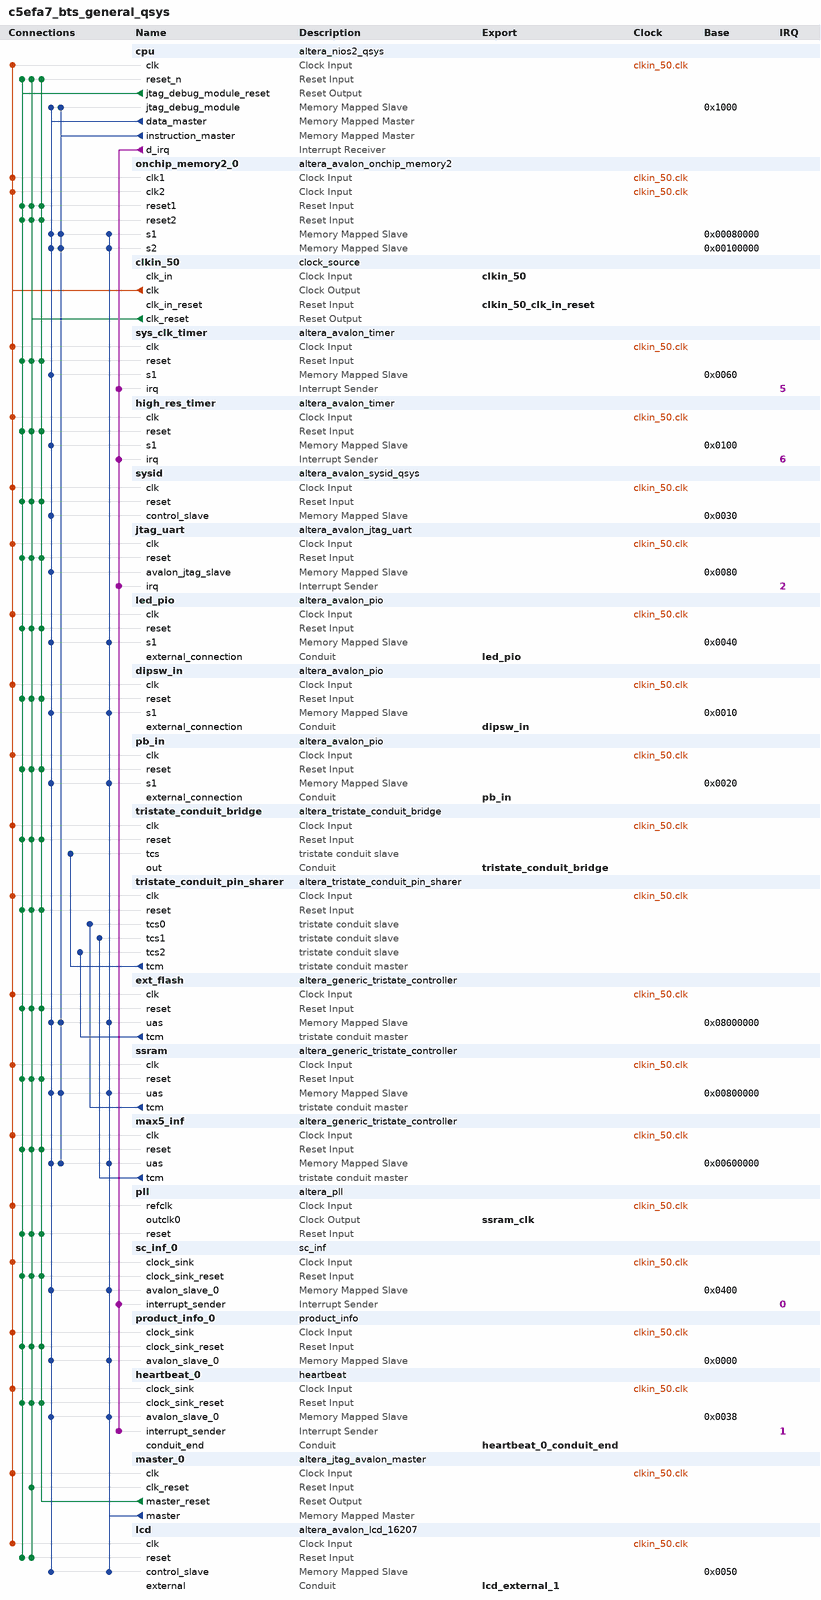
[diagram p0: system contents]
# Platform Designer (Qsys) system c5efa7_bts_general_qsys, Cyclone V 5CEFA7F31I7
# Parameters at their usual value, and those the tool derives, are not listed.
package require -exact qsys 12.1
create_system c5efa7_bts_general_qsys
set_project_property DEVICE_FAMILY {Cyclone V}
set_project_property DEVICE 5CEFA7F31I7

add_instance cpu altera_nios2_qsys 12.1
set_instance_parameter_value cpu manuallyAssignCpuID false
set_instance_parameter_value cpu exceptionOffset 96
set_instance_parameter_value cpu resetSlave onchip_memory2_0.s1
set_instance_parameter_value cpu exceptionSlave onchip_memory2_0.s1
set_instance_parameter_value cpu breakSlave cpu.jtag_debug_module
set_instance_parameter_value cpu muldiv_multiplierType DSPBlock
set_instance_parameter_value cpu impl Tiny
set_instance_parameter_value cpu icache_size 32768
set_instance_parameter_value cpu dcache_size 32768

add_instance onchip_memory2_0 altera_avalon_onchip_memory2 12.1
set_instance_parameter_value onchip_memory2_0 blockType M10K
set_instance_parameter_value onchip_memory2_0 dataWidth 32
set_instance_parameter_value onchip_memory2_0 dualPort true
set_instance_parameter_value onchip_memory2_0 initMemContent true
set_instance_parameter_value onchip_memory2_0 initializationFileName onchip_memory2_0
set_instance_parameter_value onchip_memory2_0 memorySize 524288

add_instance clkin_50 clock_source 12.1
set_instance_parameter_value clkin_50 clockFrequency 50000000

add_instance sys_clk_timer altera_avalon_timer 12.1
set_instance_parameter_value sys_clk_timer period 10
set_instance_parameter_value sys_clk_timer periodUnits MSEC
set_instance_parameter_value sys_clk_timer timerPreset CUSTOM

add_instance high_res_timer altera_avalon_timer 12.1
set_instance_parameter_value high_res_timer period 10
set_instance_parameter_value high_res_timer periodUnits USEC
set_instance_parameter_value high_res_timer timerPreset CUSTOM

add_instance sysid altera_avalon_sysid_qsys 12.1
set_instance_parameter_value sysid id 0

add_instance jtag_uart altera_avalon_jtag_uart 12.1
set_instance_parameter_value jtag_uart simInteractiveOptions INTERACTIVE_ASCII_OUTPUT

add_instance led_pio altera_avalon_pio 12.1
set_instance_parameter_value led_pio direction Output
set_instance_parameter_value led_pio width 4

add_instance dipsw_in altera_avalon_pio 12.1
set_instance_parameter_value dipsw_in direction Input
set_instance_parameter_value dipsw_in width 4

add_instance pb_in altera_avalon_pio 12.1
set_instance_parameter_value pb_in direction Input
set_instance_parameter_value pb_in width 4

add_instance tristate_conduit_bridge altera_tristate_conduit_bridge 12.1

add_instance tristate_conduit_pin_sharer altera_tristate_conduit_pin_sharer 12.1
set_instance_parameter_value tristate_conduit_pin_sharer NUM_INTERFACES 3
set_instance_parameter_value tristate_conduit_pin_sharer MODULE_ORIGIN_LIST ext_flash.tcm,ext_flash.tcm,ext_flash.tcm,ext_flash.tcm,ext_flash.tcm,max5_inf.tcm,max5_inf.tcm,max5_inf.tcm,max5_inf.tcm,max5_inf.tcm,max5_inf.tcm,ssram.tcm,ssram.tcm,ssram.tcm,ssram.tcm,ssram.tcm,ssram.tcm
set_instance_parameter_value tristate_conduit_pin_sharer SIGNAL_ORIGIN_LIST address,read_n,write_n,data,chipselect_n,address,read_n,write_n,reset,data,chipselect_n,address,outputenable_n,byteenable_n,write_n,data,chipselect_n
set_instance_parameter_value tristate_conduit_pin_sharer SHARED_SIGNAL_LIST fsm_add,,,fsm_data,,fsm_add,,,,fsm_data,,fsm_add,,,,fsm_data

add_instance ext_flash altera_generic_tristate_controller 12.1
set_instance_parameter_value ext_flash TCM_ADDRESS_W 26
set_instance_parameter_value ext_flash TCM_DATA_W 16
set_instance_parameter_value ext_flash TCM_BYTEENABLE_W 2
set_instance_parameter_value ext_flash TCM_READ_WAIT 100
set_instance_parameter_value ext_flash TCM_WRITE_WAIT 100
set_instance_parameter_value ext_flash TCM_SETUP_WAIT 25
set_instance_parameter_value ext_flash TCM_DATA_HOLD 20
set_instance_parameter_value ext_flash TCM_MAX_PENDING_READ_TRANSACTIONS 3
set_instance_parameter_value ext_flash TCM_TURNAROUND_TIME 2
set_instance_parameter_value ext_flash TCM_TIMING_UNITS 0
set_instance_parameter_value ext_flash TCM_READLATENCY 2
set_instance_parameter_value ext_flash TCM_SYMBOLS_PER_WORD 2
set_instance_parameter_value ext_flash USE_READ 1
set_instance_parameter_value ext_flash USE_BEGINTRANSFER 0
set_instance_parameter_value ext_flash USE_BYTEENABLE 0
set_instance_parameter_value ext_flash USE_OUTPUTENABLE 0
set_instance_parameter_value ext_flash ACTIVE_LOW_READ 1
set_instance_parameter_value ext_flash ACTIVE_LOW_BYTEENABLE 0
set_instance_parameter_value ext_flash ACTIVE_LOW_OUTPUTENABLE 0
set_instance_parameter_value ext_flash ACTIVE_LOW_BEGINTRANSFER 0
set_instance_parameter_value ext_flash CHIPSELECT_THROUGH_READLATENCY 0
set_instance_parameter_value ext_flash MODULE_ASSIGNMENT_KEYS embeddedsw.configuration.hwClassnameDriverSupportList,embeddedsw.configuration.hwClassnameDriverSupportDefault,embeddedsw.CMacro.SETUP_VALUE,embeddedsw.CMacro.WAIT_VALUE,embeddedsw.CMacro.HOLD_VALUE,embeddedsw.CMacro.TIMING_UNITS,embeddedsw.CMacro.SIZE,embeddedsw.memoryInfo.MEM_INIT_DATA_WIDTH,embeddedsw.memoryInfo.HAS_BYTE_LANE,embeddedsw.memoryInfo.IS_FLASH,embeddedsw.memoryInfo.GENERATE_DAT_SYM,embeddedsw.memoryInfo.GENERATE_FLASH,embeddedsw.memoryInfo.DAT_SYM_INSTALL_DIR,embeddedsw.memoryInfo.FLASH_INSTALL_DIR
set_instance_parameter_value ext_flash MODULE_ASSIGNMENT_VALUES altera_avalon_lan91c111:altera_avalon_cfi_flash,altera_avalon_cfi_flash,25,100,20,ns,33554432u,16,1,1,1,1,SIM_DIR,APP_DIR
set_instance_parameter_value ext_flash INTERFACE_ASSIGNMENT_KEYS embeddedsw.configuration.isFlash,embeddedsw.configuration.isMemoryDevice,embeddedsw.configuration.isNonVolatileStorage
set_instance_parameter_value ext_flash INTERFACE_ASSIGNMENT_VALUES 1,1,1

add_instance ssram altera_generic_tristate_controller 12.1
set_instance_parameter_value ssram TCM_ADDRESS_W 21
set_instance_parameter_value ssram TCM_DATA_W 16
set_instance_parameter_value ssram TCM_BYTEENABLE_W 2
set_instance_parameter_value ssram TCM_READ_WAIT 200
set_instance_parameter_value ssram TCM_WRITE_WAIT 200
set_instance_parameter_value ssram TCM_SETUP_WAIT 200
set_instance_parameter_value ssram TCM_DATA_HOLD 200
set_instance_parameter_value ssram TCM_MAX_PENDING_READ_TRANSACTIONS 5
set_instance_parameter_value ssram TCM_TURNAROUND_TIME 2
set_instance_parameter_value ssram TCM_TIMING_UNITS 0
set_instance_parameter_value ssram TCM_READLATENCY 4
set_instance_parameter_value ssram TCM_SYMBOLS_PER_WORD 2
set_instance_parameter_value ssram USE_READ 0
set_instance_parameter_value ssram USE_BEGINTRANSFER 0
set_instance_parameter_value ssram USE_BYTEENABLE 1
set_instance_parameter_value ssram USE_OUTPUTENABLE 1
set_instance_parameter_value ssram ACTIVE_LOW_READ 0
set_instance_parameter_value ssram ACTIVE_LOW_BYTEENABLE 1
set_instance_parameter_value ssram ACTIVE_LOW_OUTPUTENABLE 1
set_instance_parameter_value ssram ACTIVE_LOW_BEGINTRANSFER 1
set_instance_parameter_value ssram ACTIVE_LOW_RESET_OUTPUT 1
set_instance_parameter_value ssram CHIPSELECT_THROUGH_READLATENCY 1
set_instance_parameter_value ssram MODULE_ASSIGNMENT_KEYS embeddedsw.configuration.hwClassnameDriverSupportList,embeddedsw.CMacro.SRAM_MEMORY_SIZE,embeddedsw.CMacro.SRAM_MEMORY_UNITS,embeddedsw.CMacro.SSRAM_DATA_WIDTH,embeddedsw.CMacro.SSRAM_READ_LATENCY,embeddedsw.memoryInfo.MEM_INIT_DATA_WIDTH,embeddedsw.memoryInfo.HAS_BYTE_LANE,embeddedsw.memoryInfo.GENERATE_DAT_SYM,embeddedsw.memoryInfo.DAT_SYM_INSTALL_DIR
set_instance_parameter_value ssram MODULE_ASSIGNMENT_VALUES altera_avalon_lan91c111:altera_avalon_cfi_flash,2,524288,32,2,32,1,1,SIM_DIR
set_instance_parameter_value ssram INTERFACE_ASSIGNMENT_KEYS embeddedsw.configuration.isMemoryDevice
set_instance_parameter_value ssram INTERFACE_ASSIGNMENT_VALUES 1

add_instance max5_inf altera_generic_tristate_controller 12.1
set_instance_parameter_value max5_inf TCM_ADDRESS_W 9
set_instance_parameter_value max5_inf TCM_DATA_W 16
set_instance_parameter_value max5_inf TCM_BYTEENABLE_W 2
set_instance_parameter_value max5_inf TCM_READ_WAIT 4
set_instance_parameter_value max5_inf TCM_WRITE_WAIT 2
set_instance_parameter_value max5_inf TCM_SETUP_WAIT 2
set_instance_parameter_value max5_inf TCM_DATA_HOLD 2
set_instance_parameter_value max5_inf TCM_MAX_PENDING_READ_TRANSACTIONS 3
set_instance_parameter_value max5_inf TCM_TURNAROUND_TIME 2
set_instance_parameter_value max5_inf TCM_TIMING_UNITS 1
set_instance_parameter_value max5_inf TCM_READLATENCY 2
set_instance_parameter_value max5_inf TCM_SYMBOLS_PER_WORD 2
set_instance_parameter_value max5_inf USE_READ 1
set_instance_parameter_value max5_inf USE_BEGINTRANSFER 0
set_instance_parameter_value max5_inf USE_BYTEENABLE 0
set_instance_parameter_value max5_inf USE_OUTPUTENABLE 0
set_instance_parameter_value max5_inf USE_RESET_OUTPUT 1
set_instance_parameter_value max5_inf ACTIVE_LOW_READ 1
set_instance_parameter_value max5_inf ACTIVE_LOW_BYTEENABLE 0
set_instance_parameter_value max5_inf ACTIVE_LOW_OUTPUTENABLE 0
set_instance_parameter_value max5_inf ACTIVE_LOW_BEGINTRANSFER 0
set_instance_parameter_value max5_inf CHIPSELECT_THROUGH_READLATENCY 0
set_instance_parameter_value max5_inf IS_MEMORY_DEVICE 0
set_instance_parameter_value max5_inf MODULE_ASSIGNMENT_KEYS embeddedsw.configuration.hwClassnameDriverSupportList
set_instance_parameter_value max5_inf MODULE_ASSIGNMENT_VALUES "altera_avalon_lan91c111\\,altera_avalon_cfi_flash"
set_instance_parameter_value max5_inf INTERFACE_ASSIGNMENT_KEYS embeddedsw.configuration.isFlash,embeddedsw.configuration.isMemoryDevice,embeddedsw.configuration.isNonVolatileStorage,embeddedsw.configuration.isPrintableDevice
set_instance_parameter_value max5_inf INTERFACE_ASSIGNMENT_VALUES 0,0,0,0

add_instance pll altera_pll 12.1
set_instance_parameter_value pll gui_device_speed_grade 8
set_instance_parameter_value pll gui_pll_mode {Integer-N PLL}
set_instance_parameter_value pll gui_reference_clock_frequency 50.0
set_instance_parameter_value pll gui_operation_mode normal
set_instance_parameter_value pll gui_fractional_cout 24
set_instance_parameter_value pll gui_use_locked false
set_instance_parameter_value pll gui_number_of_clocks 1
set_instance_parameter_value pll gui_output_clock_frequency0 50.0

add_instance sc_inf_0 sc_inf 1.0

add_instance product_info_0 product_info 1.0

add_instance heartbeat_0 heartbeat 1.0

add_instance master_0 altera_jtag_avalon_master 12.1

add_instance lcd altera_avalon_lcd_16207 12.1

# connections
add_connection clkin_50.clk cpu.clk clock
add_connection clkin_50.clk dipsw_in.clk clock
add_connection clkin_50.clk ext_flash.clk clock
add_connection clkin_50.clk heartbeat_0.clock_sink clock
add_connection clkin_50.clk high_res_timer.clk clock
add_connection clkin_50.clk jtag_uart.clk clock
add_connection clkin_50.clk lcd.clk clock
add_connection clkin_50.clk led_pio.clk clock
add_connection clkin_50.clk master_0.clk clock
add_connection clkin_50.clk max5_inf.clk clock
add_connection clkin_50.clk onchip_memory2_0.clk1 clock
add_connection clkin_50.clk onchip_memory2_0.clk2 clock
add_connection clkin_50.clk pb_in.clk clock
add_connection clkin_50.clk pll.refclk clock
add_connection clkin_50.clk product_info_0.clock_sink clock
add_connection clkin_50.clk sc_inf_0.clock_sink clock
add_connection clkin_50.clk ssram.clk clock
add_connection clkin_50.clk sys_clk_timer.clk clock
add_connection clkin_50.clk sysid.clk clock
add_connection clkin_50.clk tristate_conduit_bridge.clk clock
add_connection clkin_50.clk tristate_conduit_pin_sharer.clk clock
add_connection clkin_50.clk_reset cpu.reset_n reset
add_connection clkin_50.clk_reset dipsw_in.reset reset
add_connection clkin_50.clk_reset ext_flash.reset reset
add_connection clkin_50.clk_reset heartbeat_0.clock_sink_reset reset
add_connection clkin_50.clk_reset high_res_timer.reset reset
add_connection clkin_50.clk_reset jtag_uart.reset reset
add_connection clkin_50.clk_reset lcd.reset reset
add_connection clkin_50.clk_reset led_pio.reset reset
add_connection clkin_50.clk_reset master_0.clk_reset reset
add_connection clkin_50.clk_reset max5_inf.reset reset
add_connection clkin_50.clk_reset onchip_memory2_0.reset1 reset
add_connection clkin_50.clk_reset onchip_memory2_0.reset2 reset
add_connection clkin_50.clk_reset pb_in.reset reset
add_connection clkin_50.clk_reset pll.reset reset
add_connection clkin_50.clk_reset product_info_0.clock_sink_reset reset
add_connection clkin_50.clk_reset sc_inf_0.clock_sink_reset reset
add_connection clkin_50.clk_reset ssram.reset reset
add_connection clkin_50.clk_reset sys_clk_timer.reset reset
add_connection clkin_50.clk_reset sysid.reset reset
add_connection clkin_50.clk_reset tristate_conduit_bridge.reset reset
add_connection clkin_50.clk_reset tristate_conduit_pin_sharer.reset reset
add_connection cpu.jtag_debug_module_reset cpu.reset_n reset
add_connection cpu.jtag_debug_module_reset dipsw_in.reset reset
add_connection cpu.jtag_debug_module_reset ext_flash.reset reset
add_connection cpu.jtag_debug_module_reset heartbeat_0.clock_sink_reset reset
add_connection cpu.jtag_debug_module_reset high_res_timer.reset reset
add_connection cpu.jtag_debug_module_reset jtag_uart.reset reset
add_connection cpu.jtag_debug_module_reset lcd.reset reset
add_connection cpu.jtag_debug_module_reset led_pio.reset reset
add_connection cpu.jtag_debug_module_reset max5_inf.reset reset
add_connection cpu.jtag_debug_module_reset onchip_memory2_0.reset1 reset
add_connection cpu.jtag_debug_module_reset onchip_memory2_0.reset2 reset
add_connection cpu.jtag_debug_module_reset pb_in.reset reset
add_connection cpu.jtag_debug_module_reset pll.reset reset
add_connection cpu.jtag_debug_module_reset product_info_0.clock_sink_reset reset
add_connection cpu.jtag_debug_module_reset sc_inf_0.clock_sink_reset reset
add_connection cpu.jtag_debug_module_reset ssram.reset reset
add_connection cpu.jtag_debug_module_reset sys_clk_timer.reset reset
add_connection cpu.jtag_debug_module_reset sysid.reset reset
add_connection cpu.jtag_debug_module_reset tristate_conduit_bridge.reset reset
add_connection cpu.jtag_debug_module_reset tristate_conduit_pin_sharer.reset reset
add_connection master_0.master_reset cpu.reset_n reset
add_connection master_0.master_reset dipsw_in.reset reset
add_connection master_0.master_reset ext_flash.reset reset
add_connection master_0.master_reset heartbeat_0.clock_sink_reset reset
add_connection master_0.master_reset high_res_timer.reset reset
add_connection master_0.master_reset jtag_uart.reset reset
add_connection master_0.master_reset led_pio.reset reset
add_connection master_0.master_reset max5_inf.reset reset
add_connection master_0.master_reset onchip_memory2_0.reset1 reset
add_connection master_0.master_reset onchip_memory2_0.reset2 reset
add_connection master_0.master_reset pb_in.reset reset
add_connection master_0.master_reset pll.reset reset
add_connection master_0.master_reset product_info_0.clock_sink_reset reset
add_connection master_0.master_reset sc_inf_0.clock_sink_reset reset
add_connection master_0.master_reset ssram.reset reset
add_connection master_0.master_reset sys_clk_timer.reset reset
add_connection master_0.master_reset sysid.reset reset
add_connection master_0.master_reset tristate_conduit_bridge.reset reset
add_connection master_0.master_reset tristate_conduit_pin_sharer.reset reset
add_connection cpu.data_master cpu.jtag_debug_module avalon
set_connection_parameter_value cpu.data_master/cpu.jtag_debug_module baseAddress 0x1000
add_connection cpu.data_master dipsw_in.s1 avalon
set_connection_parameter_value cpu.data_master/dipsw_in.s1 baseAddress 0x0010
add_connection cpu.data_master ext_flash.uas avalon
set_connection_parameter_value cpu.data_master/ext_flash.uas baseAddress 0x08000000
add_connection cpu.data_master heartbeat_0.avalon_slave_0 avalon
set_connection_parameter_value cpu.data_master/heartbeat_0.avalon_slave_0 baseAddress 0x0038
add_connection cpu.data_master high_res_timer.s1 avalon
set_connection_parameter_value cpu.data_master/high_res_timer.s1 baseAddress 0x0100
add_connection cpu.data_master jtag_uart.avalon_jtag_slave avalon
set_connection_parameter_value cpu.data_master/jtag_uart.avalon_jtag_slave baseAddress 0x0080
add_connection cpu.data_master lcd.control_slave avalon
set_connection_parameter_value cpu.data_master/lcd.control_slave baseAddress 0x0050
add_connection cpu.data_master led_pio.s1 avalon
set_connection_parameter_value cpu.data_master/led_pio.s1 baseAddress 0x0040
add_connection cpu.data_master max5_inf.uas avalon
set_connection_parameter_value cpu.data_master/max5_inf.uas baseAddress 0x00600000
add_connection cpu.data_master onchip_memory2_0.s1 avalon
set_connection_parameter_value cpu.data_master/onchip_memory2_0.s1 baseAddress 0x00080000
add_connection cpu.data_master onchip_memory2_0.s2 avalon
set_connection_parameter_value cpu.data_master/onchip_memory2_0.s2 baseAddress 0x00100000
add_connection cpu.data_master pb_in.s1 avalon
set_connection_parameter_value cpu.data_master/pb_in.s1 baseAddress 0x0020
add_connection cpu.data_master product_info_0.avalon_slave_0 avalon
set_connection_parameter_value cpu.data_master/product_info_0.avalon_slave_0 baseAddress 0x0000
add_connection cpu.data_master sc_inf_0.avalon_slave_0 avalon
set_connection_parameter_value cpu.data_master/sc_inf_0.avalon_slave_0 baseAddress 0x0400
add_connection cpu.data_master ssram.uas avalon
set_connection_parameter_value cpu.data_master/ssram.uas baseAddress 0x00800000
add_connection cpu.data_master sys_clk_timer.s1 avalon
set_connection_parameter_value cpu.data_master/sys_clk_timer.s1 baseAddress 0x0060
add_connection cpu.data_master sysid.control_slave avalon
set_connection_parameter_value cpu.data_master/sysid.control_slave baseAddress 0x0030
add_connection cpu.instruction_master cpu.jtag_debug_module avalon
set_connection_parameter_value cpu.instruction_master/cpu.jtag_debug_module baseAddress 0x1000
add_connection cpu.instruction_master ext_flash.uas avalon
set_connection_parameter_value cpu.instruction_master/ext_flash.uas baseAddress 0x08000000
add_connection cpu.instruction_master max5_inf.uas avalon
set_connection_parameter_value cpu.instruction_master/max5_inf.uas baseAddress 0x00600000
add_connection cpu.instruction_master onchip_memory2_0.s1 avalon
set_connection_parameter_value cpu.instruction_master/onchip_memory2_0.s1 baseAddress 0x00080000
add_connection cpu.instruction_master onchip_memory2_0.s2 avalon
set_connection_parameter_value cpu.instruction_master/onchip_memory2_0.s2 baseAddress 0x00100000
add_connection cpu.instruction_master ssram.uas avalon
set_connection_parameter_value cpu.instruction_master/ssram.uas baseAddress 0x00800000
add_connection master_0.master dipsw_in.s1 avalon
set_connection_parameter_value master_0.master/dipsw_in.s1 baseAddress 0x0010
add_connection master_0.master ext_flash.uas avalon
set_connection_parameter_value master_0.master/ext_flash.uas baseAddress 0x08000000
add_connection master_0.master heartbeat_0.avalon_slave_0 avalon
set_connection_parameter_value master_0.master/heartbeat_0.avalon_slave_0 baseAddress 0x0038
add_connection master_0.master lcd.control_slave avalon
set_connection_parameter_value master_0.master/lcd.control_slave baseAddress 0x0050
add_connection master_0.master led_pio.s1 avalon
set_connection_parameter_value master_0.master/led_pio.s1 baseAddress 0x0040
add_connection master_0.master max5_inf.uas avalon
set_connection_parameter_value master_0.master/max5_inf.uas baseAddress 0x00600000
add_connection master_0.master onchip_memory2_0.s1 avalon
set_connection_parameter_value master_0.master/onchip_memory2_0.s1 baseAddress 0x00080000
add_connection master_0.master onchip_memory2_0.s2 avalon
set_connection_parameter_value master_0.master/onchip_memory2_0.s2 baseAddress 0x00100000
add_connection master_0.master pb_in.s1 avalon
set_connection_parameter_value master_0.master/pb_in.s1 baseAddress 0x0020
add_connection master_0.master product_info_0.avalon_slave_0 avalon
set_connection_parameter_value master_0.master/product_info_0.avalon_slave_0 baseAddress 0x0000
add_connection master_0.master sc_inf_0.avalon_slave_0 avalon
set_connection_parameter_value master_0.master/sc_inf_0.avalon_slave_0 baseAddress 0x0400
add_connection master_0.master ssram.uas avalon
set_connection_parameter_value master_0.master/ssram.uas baseAddress 0x00800000
add_connection cpu.d_irq heartbeat_0.interrupt_sender interrupt
set_connection_parameter_value cpu.d_irq/heartbeat_0.interrupt_sender irqNumber 1
add_connection cpu.d_irq high_res_timer.irq interrupt
set_connection_parameter_value cpu.d_irq/high_res_timer.irq irqNumber 6
add_connection cpu.d_irq jtag_uart.irq interrupt
set_connection_parameter_value cpu.d_irq/jtag_uart.irq irqNumber 2
add_connection cpu.d_irq sc_inf_0.interrupt_sender interrupt
set_connection_parameter_value cpu.d_irq/sc_inf_0.interrupt_sender irqNumber 0
add_connection cpu.d_irq sys_clk_timer.irq interrupt
set_connection_parameter_value cpu.d_irq/sys_clk_timer.irq irqNumber 5
add_connection ext_flash.tcm tristate_conduit_pin_sharer.tcs2 tristate_conduit
add_connection max5_inf.tcm tristate_conduit_pin_sharer.tcs1 tristate_conduit
add_connection ssram.tcm tristate_conduit_pin_sharer.tcs0 tristate_conduit
add_connection tristate_conduit_pin_sharer.tcm tristate_conduit_bridge.tcs tristate_conduit

# exported interfaces
add_interface clkin_50 clock sink
set_interface_property clkin_50 EXPORT_OF clkin_50.clk_in
add_interface led_pio conduit end
set_interface_property led_pio EXPORT_OF led_pio.external_connection
add_interface clkin_50_clk_in_reset reset sink
set_interface_property clkin_50_clk_in_reset EXPORT_OF clkin_50.clk_in_reset
add_interface tristate_conduit_bridge conduit end
set_interface_property tristate_conduit_bridge EXPORT_OF tristate_conduit_bridge.out
add_interface heartbeat_0_conduit_end conduit end
set_interface_property heartbeat_0_conduit_end EXPORT_OF heartbeat_0.conduit_end
add_interface dipsw_in conduit end
set_interface_property dipsw_in EXPORT_OF dipsw_in.external_connection
add_interface pb_in conduit end
set_interface_property pb_in EXPORT_OF pb_in.external_connection
add_interface lcd_external_1 conduit end
set_interface_property lcd_external_1 EXPORT_OF lcd.external
add_interface ssram_clk clock source
set_interface_property ssram_clk EXPORT_OF pll.outclk0

save_system c5efa7_bts_general_qsys.qsys
